# EAGLE design VoltageReferenceProgrammableRevD (EAGLE 6.6.0)
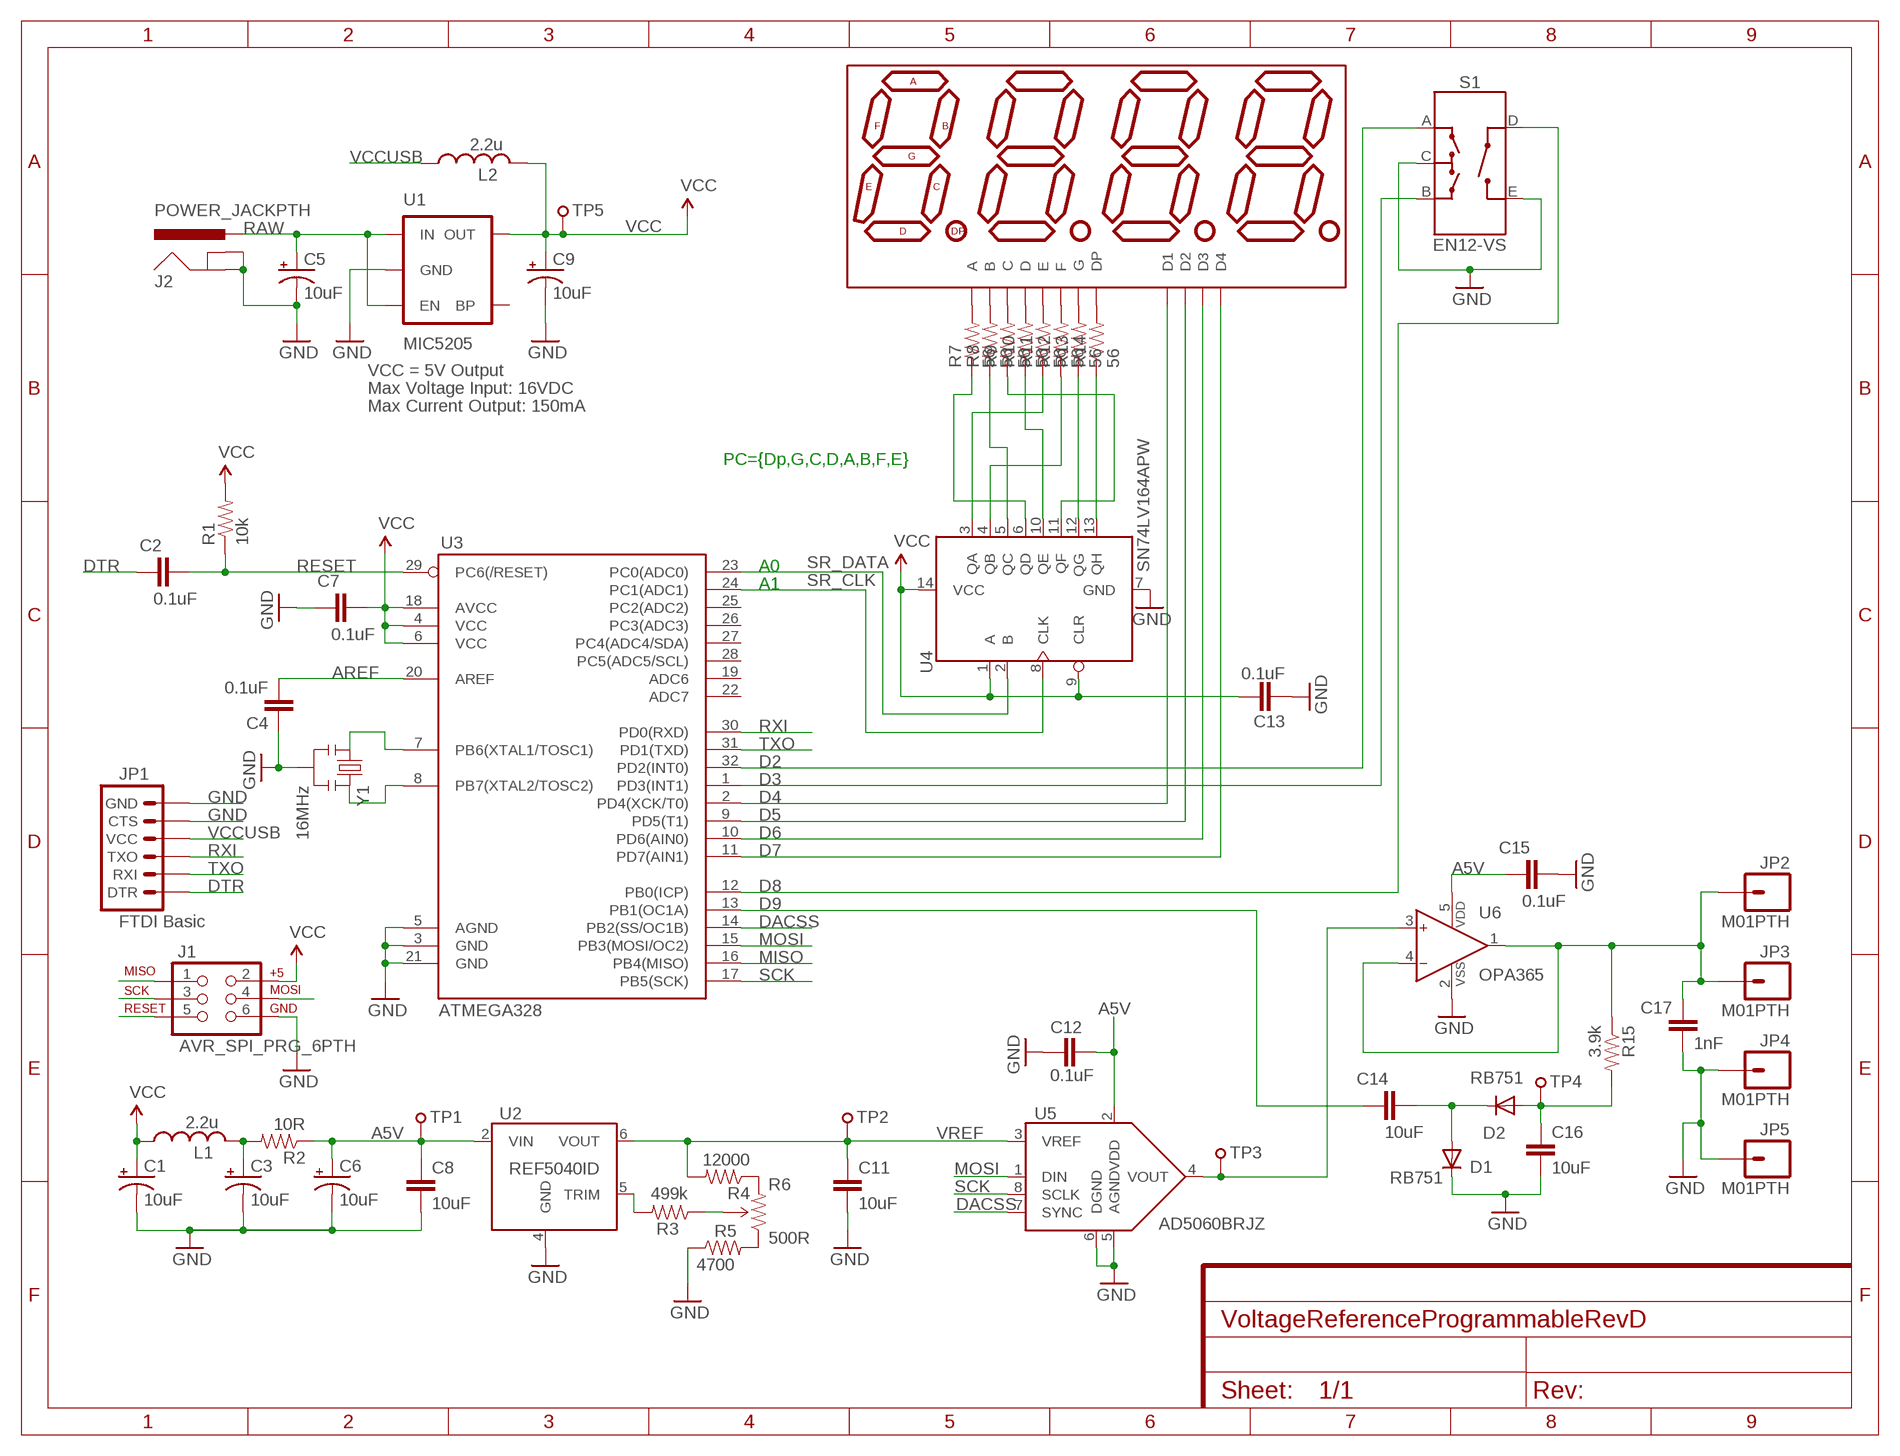
[diagram p0: schematic, sheet 1]

## Parts
C1  10uF  CAP_POL0805  [0805-POL]
C2  0.1uF  CAP0805  [0805]
C3  10uF  CAP_POL0805  [0805-POL]
C4  0.1uF  CAP0805  [0805]
C5  10uF  CAP_POL0805  [0805-POL]
C6  10uF  CAP_POL0805  [0805-POL]
C7  0.1uF  CAP0805  [0805]
C8  10uF  CAP0805  [0805]
C9  10uF  CAP_POL0805  [0805-POL]
C11  10uF  CAP0805  [0805]
C12  0.1uF  CAP0805  [0805]
C13  0.1uF  CAP0805  [0805]
C14  10uF  CAP0805  [0805]
C15  0.1uF  CAP0805  [0805]
C16  10uF  CAP0805  [0805]
C17  1nF  CAP0805  [0805]
D1  RB751  DIODESOD  [SOD-323]
D2  RB751  DIODESOD  [SOD-323]
DISP1  hp  7-SEGMENT-4DIGIT-COUNTER-HP-BUBBLE  [DIL12]
FRAME1  FRAME_LTR_CU_MARK  [FR-LTR-ON-PCB]
J1  AVR_SPI_PRG_6PTH  [2X3]
J2  POWER_JACKPTH  [POWER_JACK_PTH]
JP1  FTDI Basic  ARDUINO_SERIAL_PROGRAMPTH  [1X06]
JP2  M01PTH  [1X01]
JP3  M01PTH  [1X01]
JP4  M01PTH  [1X01]
JP5  M01PTH  [1X01]
L1  2.2u  INDUCTOR  [0805]
L2  2.2u  INDUCTOR  [0805]
R1  10k  RESISTOR0805-RES  [0805]
R2  10R  RESISTOR0805-RES  [0805]
R3  499k  RESISTOR0805-RES  [0805]
R4  12000  RESISTOR0805-RES  [0805]
R5  4700  RESISTOR0805-RES  [0805]
R6  500R  TRIMPOT  [T93YB]
R7  56  RESISTOR0805-RES  [0805]
R8  56  RESISTOR0805-RES  [0805]
R9  56  RESISTOR0805-RES  [0805]
R10  56  RESISTOR0805-RES  [0805]
R11  56  RESISTOR0805-RES  [0805]
R12  56  RESISTOR0805-RES  [0805]
R13  56  RESISTOR0805-RES  [0805]
R14  56  RESISTOR0805-RES  [0805]
R15  3.9k  RESISTOR0805-RES  [0805]
S1  EN12-VS  [ROTARY_ENCODER_SIDE]
TP1  TEST_POINT  [BBD-VIA]
TP2  TEST_POINT  [BBD-VIA]
TP3  TEST_POINT  [BBD-VIA]
TP4  TEST_POINT  [BBD-VIA]
TP5  TEST_POINT  [BBD-VIA]
U1  MIC5205  V_REG_LDOSMD  [SOT23-5]
U2  REF5040ID  [SOIC-8-MINUSPINS]
U3  ATMEGA328  ATMEGA168  [TQFP32-08]
U4  SN74LV164APW  [TSSOP-14(TI)]
U5  AD5060BRJZ  AD5040BRJZ  [SOT-23-8]
U6  OPA365  [SOT-23-5]
Y1  16MHz  RESONATORSMD  [RESONATOR-SMD]

## Nets
A5V: C6.1(+) C8.1 C12.1 C15.1 R2.1 TP1.P$1 U2.2(VIN) U5.2(VDD) U6.5(VDD)
ADCIN: C16.1 D2.2(A) R15.2 TP4.P$1
AREF: C4.2 U3.20(AREF)
D2: S1.A U3.32(PD2(INT0))
D3: S1.B U3.1(PD3(INT1))
D4: DISP1.1(D1) U3.2(PD4(XCK/T0))
D5: DISP1.10(D2) U3.9(PD5(T1))
D6: DISP1.4(D3) U3.10(PD6(AIN0))
D7: DISP1.6(D4) U3.11(PD7(AIN1))
D8: S1.D U3.12(PB0(ICP))
D9: C14.1 U3.13(PB1(OC1A))
DACSS: U3.14(PB2(SS/OC1B)) U5.7(SYNC)
DTR: C2.1 JP1.1(DTR)
GND [vcc]: C1.2(-) C3.2(-) C4.1 C5.2(-) C6.2(-) C7.1 C8.2 C9.2(-) C11.2 C12.2 C13.2 C15.2 C16.2 C17.1 D1.1(C) J1.6 J2.GND J2.GNDBREAK JP1.5(CTS) JP1.6(GND) JP4.1 JP5.1 R5.1 S1.C S1.E U1.2(GND) U2.4(GND) U3.3(GND) U3.5(AGND) U3.21(GND) U4.7(GND) U5.5(AGND) U5.6(DGND) U6.2(VSS) Y1.2
MISO: J1.1 U3.16(PB4(MISO))
MOSI: J1.4 U3.15(PB3(MOSI/OC2)) U5.1(DIN)
N$1: U3.7(PB6(XTAL1/TOSC1)) Y1.1
N$2: U3.8(PB7(XTAL2/TOSC2)) Y1.3
N$3: DISP1.12(A) R7.2
N$4: DISP1.11(B) R8.2
N$5: DISP1.3(C) R9.2
N$6: DISP1.8(D) R10.2
N$7: R14.1 U4.13(QH)
N$8: DISP1.2(E) R11.2
N$9: DISP1.9(F) R12.2
N$10: DISP1.7(G) R13.2
N$11: DISP1.5(DP) R14.2
N$12: TP3.P$1 U5.4(VOUT) U6.3(IN+)
N$13: C17.2 JP2.1 JP3.1 R15.1 U6.1(OUT) U6.4(IN-)
N$14: R3.1 R6.2(WIPER)
N$15: R13.1 U4.12(QG)
N$16: C14.2 D1.2(A) D2.1(C)
N$17: R3.2 U2.5(TRIM)
N$18: R5.2 R6.1(CCW)
N$19: R4.1 R6.3(CW)
N$20: R9.1 U4.11(QF)
N$21: R10.1 U4.10(QE)
N$22: R7.1 U4.6(QD)
N$23: R8.1 U4.5(QC)
N$24: R12.1 U4.4(QB)
N$25: R11.1 U4.3(QA)
N$26: C3.1(+) L1.2 R2.2
RAW [vcc]: C5.1(+) J2.PWR U1.1(IN) U1.3(EN)
RESET: C2.2 J1.5 R1.1 U3.29(PC6(/RESET))
RXI: JP1.3(TXO) U3.30(PD0(RXD))
SCK: J1.3 U3.17(PB5(SCK)) U5.8(SCLK)
SR_CLK: U3.24(PC1(ADC1)) U4.8(CLK)
SR_DATA: U3.23(PC0(ADC0)) U4.2(B)
TXO: JP1.2(RXI) U3.31(PD1(TXD))
VCC: C1.1(+) C7.2 C9.1(+) C13.1 J1.2 L1.1 L2.2 R1.2 TP5.P$1 U1.5(OUT) U3.4(VCC) U3.6(VCC) U3.18(AVCC) U4.1(A) U4.9(CLR) U4.14(VCC)
VCCUSB: JP1.4(VCC) L2.1
VREF: C11.1 R4.2 TP2.P$1 U2.6(VOUT) U5.3(VREF)
Unconnected: U1.4(BP) U3.19(ADC6) U3.22(ADC7) U3.25(PC2(ADC2)) U3.26(PC3(ADC3)) U3.27(PC4(ADC4/SDA)) U3.28(PC5(ADC5/SCL))

## Notes on the sheet
- VCC = 5V Output
- Max Voltage Input: 16VDC
- Max Current Output: 150mA
- PC={Dp,G,C,D,A,B,F,E}
- A0
- A1

## Library data of the parts
C1 C3 C5 C6 C9 = ChipsParts:CAP_POL
C2 C4 C7 C8 C11-C17 = SparkFun-Capacitors:CAP: Capacitor Standard 0603 ceramic capacitor, and 0.1" leaded capacitor.
D1 D2 = SparkFun-DiscreteSemi:DIODE: Diode These are standard reverse protection diodes and small signal diodes. SMA package can handle up to about 1A. SOD-323 can handle about 200mA. What the SOD-323 package when ordering, there are some mfgs out there that are 5-pin packages.
DISP1 = SparkFun-Displays:7-SEGMENT-4DIGIT-COUNTER
FRAME1 = NewFrame:FRAME_LTR_CU_MARK: This frame is sized for an 8.5x11" page with a 0.25" margin. It also places a name, datecode and revision mark in the bottom copper layer of the PCB.; CNAME: C.Schnarel; CREVISION: ProgVRef Rev-D; DATECODE: 24AUG2014; DESIGNER: C.Schnarel
J1 = SparkFun-Connectors:AVR_SPI_PRG_6: AVR ISP 6 Pin This is the reduced ISP connector for AVR programming. Common on Arduino. This footprint will take up less PCB space and can be used with a 10-pin to 6-pin adapter such as SKU: BOB-08508 **Special note about "TEST_POINT" package. The stop mask is on the top side, so if you want your programming test points to be on the bottom of your board, make sure to place this package on the bottom side of the board. This also ensure that the orientation to program from the bottom side will be correct.
J2 = SparkFun-Connectors:POWER_JACK: Power Jack This is the standard 5.5mm barrel jack for power. The PTH is the most common, proven, reliable, footprint. The Slot footprint only works if the mill layer is transmitted to the PCB fab house so be warned. Spark Fun Electronics SKU : PRT-00119 SMT: CONN-08106 Mating wall wart : TOL-00298 (and others)
JP1 = SparkFun:ARDUINO_SERIAL_PROGRAM
JP2-JP5 = SparkFun-Connectors:M01: Header 1 Standard 1-pin 0.1" header. Use with straight break away headers (SKU : PRT-00116), right angle break away headers (PRT-00553), swiss pins (PRT-00743), machine pins (PRT-00117), and female headers (PRT-00115).
L1 L2 = ChipsParts:INDUCTOR: Inductor, SMT chip, 0805 pkg
R1-R5 R7-R15 = SparkFun-Resistors:RESISTOR: Resistor Basic schematic elements and footprints for 0603, 1206, and PTH resistors.
R6 = ChipsParts:TRIMPOT: Various small potentiometers for "set-and-forget" applications
S1 = ChipsParts:EN12-VS: Rotary Encoder w push switch, quadrature, 12 pulse/rev. BI Technologies. Digi-key#987-1198-ND
TP1-TP5 = ChipsParts:TEST_POINT: Test Point
U1 = SparkFun:V_REG_LDO: Voltage Regulator LDO Standard 150mA LDO voltage regulator in SOT-23 layout. Micrel part MIC5205. BP (by-pass) pin is used to lower output noise with 470pF cap.
U2 = ChipsParts:REF5040
U3 = SparkFun:ATMEGA168
U4 = ChipsParts:SN74LV164A: 8-BIT SERIAL-IN PARALLEL-OUT SHIFT REGISTER with clear
U5 = ChipsParts:AD5040
U6 = ChipsParts:OPA365: OpAmp, 50MHz, R-to-R, single-supply, CMOS, TI, Digi-Key#296-20645-1-ND
Y1 = SparkFun-FreqCtrl:RESONATOR: Resonator Small SMD resonator. This is the itty bitty 10/20MHz resonators with built in caps. CSTCE10M0G55 and CSTCE20M0V53. Footprint has been reviewed closely but hasn't been tested yet.

## Net classes
1 vcc: width 0.254 mm

## Board
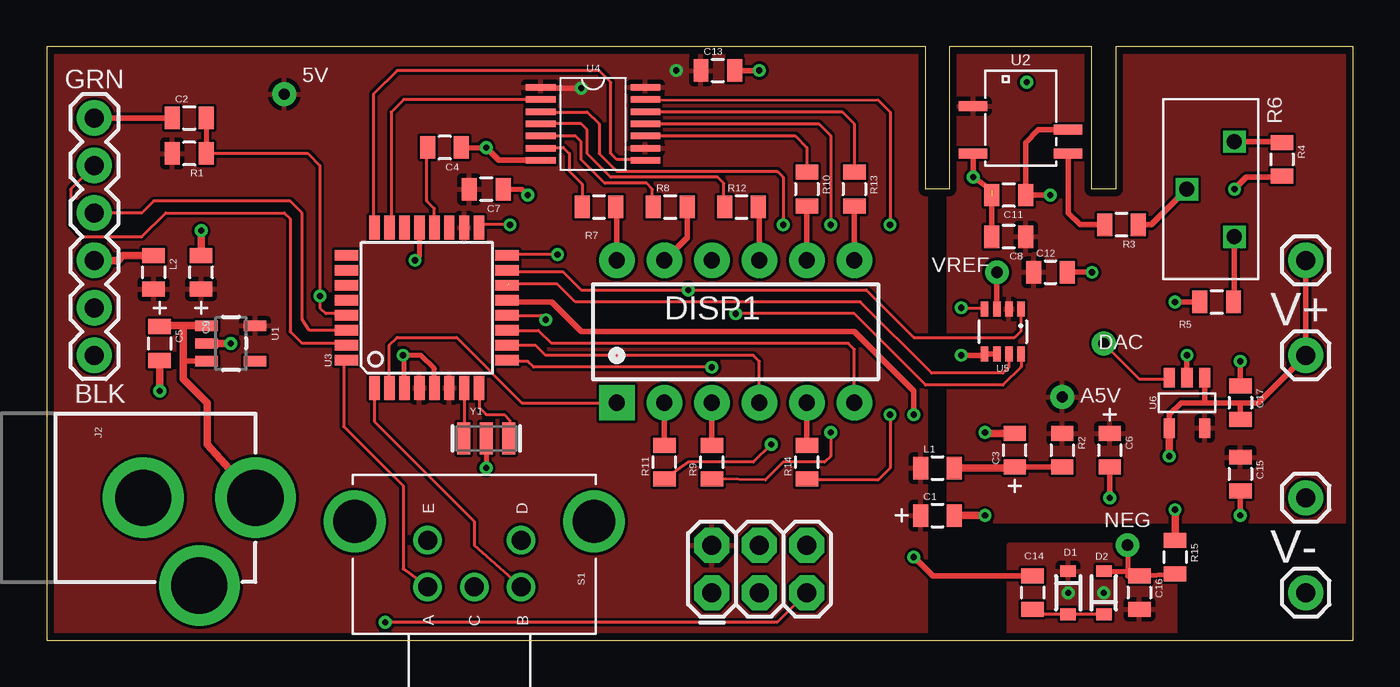
[diagram p1: board, top side]
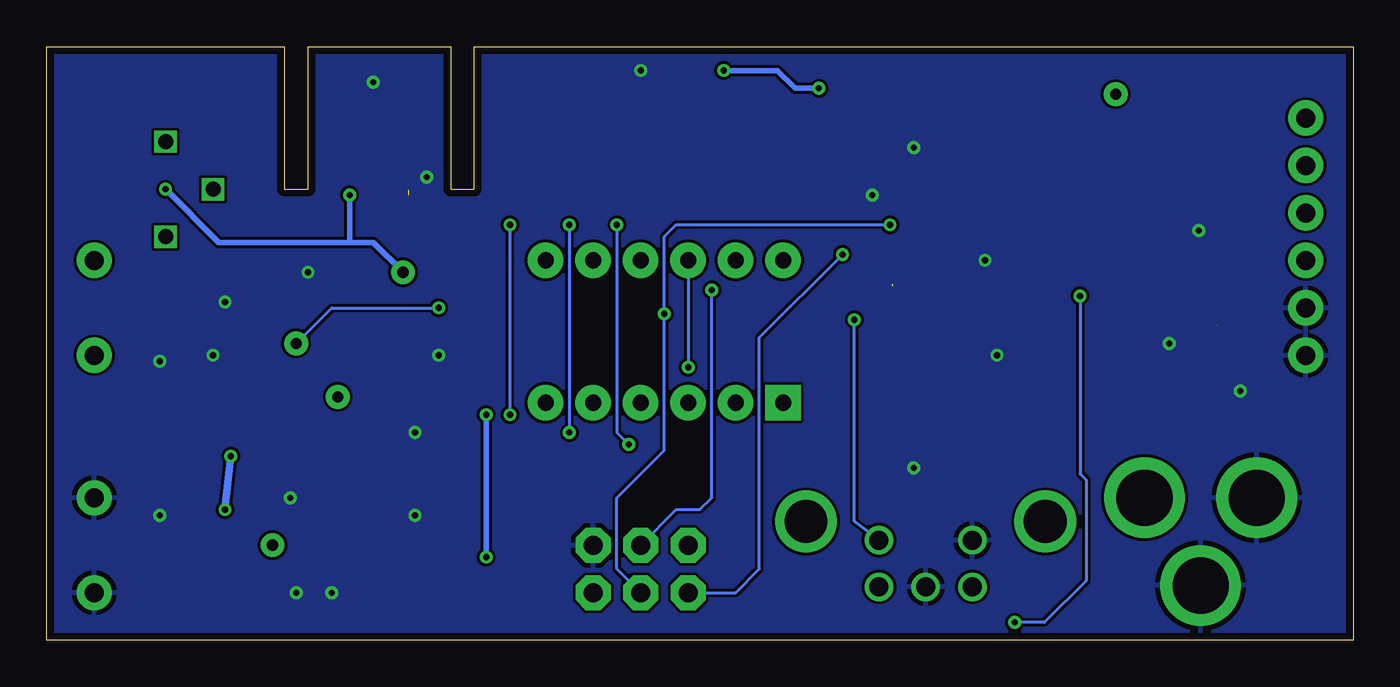
[diagram p2: board, bottom side, seen from below]

Size 69.85 x 31.75 mm. Coordinates in mm from the lower left corner, seen from the top.
Outline: 0,0 69.85,0 69.85,31.75 57.15,31.75 57.15,24.13 55.88,24.13 55.88,31.75 48.26,31.75 48.26,24.13 46.99,24.13 46.99,31.75 0,31.75 0,0
Copper layers (1*16): Top 0.0356mm / dielectric 1.5011mm / Bottom 0.0356mm
Design rules "LaenPCBOrder": minimum track width 6mil, minimum drill 13mil, track to track 6mil, track to pad 6mil, pad to pad 6mil, via to via 6mil, smd to smd 6mil, copper to edge 15mil, drill to drill 6mil, minimum pad ring 7mil, minimum via ring 7mil, stop-mask expansion 4mil, vias tented up to drill 0mil, thermal gap 10mil

### Footprints (pad centres in the part's own frame; a part is rotated, then mirrored left to right if it is on the bottom)
0805-POL = smd 0.8 x 1.2: 1 -0.9,0; 2 0.9,0
0805 = smd 0.8 x 1.2: 1 -0.9,0; 2 0.9,0
SOD-323 = smd 0.63 x 0.83: 1 -1.15,0; 2 1.15,0
DIL12 = drill 0.864 pad 1.905 square: 1 -6.35,-3.81 | drill 0.864 pad 1.905: 2 -3.81,-3.81; 3 -1.27,-3.81; 4 1.27,-3.81; 5 3.81,-3.81; 6 6.35,-3.81; 7 6.35,3.81; 8 3.81,3.81; 9 1.27,3.81; 10 -1.27,3.81; 11 -3.81,3.81; 12 -6.35,3.81
2X3 = drill 1.016 pad 1.88 octagon: 1 0,0; 2 0,2.54; 3 2.54,0; 4 2.54,2.54; 5 5.08,0; 6 5.08,2.54
POWER_JACK_PTH = drill 2.997 pad 4.318: GND 0,7.7; GNDBREAK 4.7,10.7; PWR 0,13.7
1X06 = drill 1.016 pad 1.88: 1 0,0; 2 2.54,0; 3 5.08,0; 4 7.62,0; 5 10.16,0; 6 12.7,0
1X01 = drill 1.016 pad 1.88: 1 0,0
T93YB = drill 0.8 square: 1 -1.27,2.54; 2 1.27,0; 3 -1.27,-2.54
ROTARY_ENCODER_SIDE = drill 1.016: A 3.5,-2.5; B 3.5,2.5; C 3.5,0; D 1,2.5; E 1,-2.5 | drill 2.286: P$3 0,6.4; P$4 0,-6.4
BBD-VIA = drill 0.6 pad 1.27: P$1 0,0
SOT23-5 = smd 0.55 x 1.2: 1 -0.95,-1.3; 2 0,-1.3; 3 0.95,-1.3; 4 0.95,1.3; 5 -0.95,1.3
SOIC-8-MINUSPINS = smd 1.524 x 0.53: 2 -2.54,0.635; 4 -2.54,-1.905; 5 2.54,-1.905; 6 2.54,-0.635
TQFP32-08 = smd 1.27 x 0.559: 1 -4.293,2.8; 2 -4.293,2; 3 -4.293,1.2; 4 -4.293,0.4; 5 -4.293,-0.4; 6 -4.293,-1.2; 7 -4.293,-2; 8 -4.293,-2.8; 17 4.293,-2.8; 18 4.293,-2; 19 4.293,-1.2; 20 4.293,-0.4; 21 4.293,0.4; 22 4.293,1.2; 23 4.293,2; 24 4.293,2.8 | smd 0.559 x 1.27: 9 -2.8,-4.293; 10 -2,-4.293; 11 -1.2,-4.293; 12 -0.4,-4.293; 13 0.4,-4.293; 14 1.2,-4.293; 15 2,-4.293; 16 2.8,-4.293; 25 2.8,4.293; 26 2,4.293; 27 1.2,4.293; 28 0.4,4.293; 29 -0.4,4.293; 30 -1.2,4.293; 31 -2,4.293; 32 -2.8,4.293
TSSOP-14(TI) = smd 1.6 x 0.35: 1 -2.8,1.95; 2 -2.8,1.3; 3 -2.8,0.65; 4 -2.8,0; 5 -2.8,-0.65; 6 -2.8,-1.3; 7 -2.8,-1.95; 8 2.8,-1.95; 9 2.8,-1.3; 10 2.8,-0.65; 11 2.8,0; 12 2.8,0.65; 13 2.8,1.3; 14 2.8,1.95
SOT-23-8 = smd 0.4 x 0.8: 1 -0.975,-1.2; 2 -0.325,-1.2; 3 0.325,-1.2; 4 0.975,-1.2; 5 0.975,1.2; 6 0.325,1.2; 7 -0.325,1.2; 8 -0.975,1.2
SOT-23-5 = smd 0.6 x 1.05: 1 -0.95,-1.35; 2 0,-1.35; 3 0.95,-1.35; 4 0.95,1.35; 5 -0.95,1.35
RESONATOR-SMD = smd 0.7 x 1.7: 1 -1.2,0; 2 0,0; 3 1.2,0

### Placement (x,y rotation side)
C1  47.62,6.67 0 top
C2  7.62,27.94 0 top
C3  51.75,10.16 90 top
C4  21.27,26.35 180 top
C5  6.03,15.88 270 top
C6  56.83,10.16 270 top
C7  23.5,24.13 180 top
C8  51.44,21.59 180 top
C9  8.26,19.68 90 top
C11  51.44,23.81 180 top
C12  53.66,19.68 0 top
C13  35.88,30.48 0 top
C14  52.7,2.54 270 top
C15  63.82,8.89 270 top
C16  58.42,2.54 270 top
C17  63.82,12.7 270 top
D1  54.61,2.54 270 top
D2  56.52,2.54 90 top
DISP1  36.83,16.51 0 top
FRAME1  45.72,27.62 0 top
J1  35.56,2.54 0 top
J2  -2.54,7.62 270 top
JP1  2.54,27.94 270 top
JP2  67.31,15.24 0 top
JP3  67.31,20.32 0 top
JP4  67.31,2.54 0 top
JP5  67.31,7.62 0 top
L1  47.62,9.21 0 top
L2  5.71,19.68 270 top
R1  7.62,26.04 180 top
R2  54.29,10.16 270 top
R3  57.47,22.23 180 top
R4  66.04,25.72 270 top
R5  62.55,18.1 0 top
R6  62.23,24.13 180 top
R7  29.53,23.18 0 top
R8  33.34,23.18 0 top
R9  35.56,9.53 90 top
R10  40.64,24.13 270 top
R11  33.02,9.53 90 top
R12  37.15,23.18 0 top
R13  43.18,24.13 270 top
R14  40.64,9.53 90 top
R15  60.33,4.45 270 top
S1  22.86,6.35 270 top
TP1  54.29,13.02 0 top
TP2  50.8,19.68 0 top
TP3  56.52,15.88 0 top
TP4  57.78,5.08 0 top
TP5  12.7,29.21 0 top
U1  9.84,15.88 270 top
U2  52.07,27.94 0 top
U3  20.32,17.78 90 top
U4  29.21,27.62 0 top
U5  51.12,16.51 180 top
U6  60.96,12.7 180 top
Y1  23.5,10.79 0 top

### Tracks (layer width: path | path; a pad name or v marks a point on that pad's centre or on a via)
A5V
  pour Top: 48.26,31.75 55.88,31.75 55.88,24.13 57.15,24.13 57.15,31.75 69.85,31.75 69.85,6.35 48.26,6.35
ADCIN
  Top 0.152: 58.17,3.69 C16.1
  Top 0.254: D2.2 58.17,3.69 | R15.2 C16.1 57.78,3.44 TP4.P$1
AREF
  Top 0.152: U3.20 20.72,23.09 20.32,23.5 20.32,26.3 C4.2
D2
  Top 0.152: S1.A 19.05,3.81 19.05,8.26 15.88,11.43 15.88,14.83 U3.32
D3
  Top 0.152: U3.1 17.52,11.69 22.86,6.35 22.86,5.08 S1.B
D4
  Top 0.152: U3.2 18.32,15.78 18.73,16.19 21.91,16.19 25.4,12.7 DISP1.1
D5  (via drill 0.33)
  Top 0.152: v35.56,14.61 26.04,14.61 25.72,14.92 24.67,14.92 U3.9
  Bottom 0.152: DISP1.10 v35.56,14.61
D6
  Top 0.152: DISP1.4 38.1,14.92 37.78,15.24 26.67,15.24 26.13,15.78 U3.10
D7
  Top 0.152: DISP1.6 43.18,15.56 42.86,15.88 26.99,15.88 26.28,16.58 U3.11
D8  (via drill 0.33)
  Top 0.152: U3.12 26.43,17.38 v26.67,17.14
  Bottom 0.152: S1.D 25.4,5.39 26.67,6.35 v26.67,17.14
D9  (via drill 0.33 pad 0.69)
  Top 0.305: U3.13 24.7,18.1 26.99,18.1 28.57,16.51 43.18,16.51 46.35,13.34 v46.35,12.06 | v46.35,4.45 47.36,3.44 C14.1
  Bottom 0.305: v46.35,12.06 v46.35,4.45
DACSS  (1 unrouted)
  Top 0.152: U5.7 51.44,14.61 51.12,14.29 47.31,14.29 43.5,18.1 28.26,18.1 27.3,19.05 24.68,19.05
DTR
  Top 0.305: C2.1 JP1.1
GND  (via drill 0.33, 0.33 pad 0.69)  (1 unrouted)
  Top 0.254: C4.1 v23.5,26.35 | C7.1 25.4,24.13 v25.72,23.81 | U3.21 19.92,20.55 v19.68,20.32 | U3.3 19.12,15.17 v19.05,15.24 20,15.24 20.72,14.52 U3.5 | Y1.2 v23.5,9.21
  Top 0.305: U2.4 v49.53,24.77 50.53,24.08 C8.2 | C12.2 v55.88,19.68 | U5.6 U5.5 | 50.07,15.24 v48.9,15.24 | R5.1 v60.33,18.1 | C15.2 v63.82,6.67 | C6.2 v56.83,7.62 | U6.2 v60.96,15.24 | U4.7 24.18,25.67 v23.5,26.35 | C13.2 v38.1,30.48 | C17.1 v63.82,14.92
  Top 0.406: U5.5 50.07,15.24 | C5.2 v6.03,13.34 | U1.2 v9.84,15.88 | C9.2 v8.26,21.91 | C3.2 50.22,11.06 v50.16,11.11 | C1.2 v50.16,6.67
  other vias: 52.39,29.84 54.61,2.54 56.52,2.54
  pour Top: 51.44,0 60.33,0 60.33,5.08 51.44,5.08
  pour Bottom: 0,0 69.85,0 69.85,31.75 57.15,31.75 57.15,24.13 55.88,24.13 55.88,31.75 48.26,31.75 48.26,24.13 46.99,24.13 46.99,31.75 0,31.75
MISO  (via drill 0.33 pad 0.69)
  Top 0.152: v27.3,20.64 24.67,20.64 U3.16
  Bottom 0.152: J1.1 33.02,2.54 31.75,3.81 31.75,16.19 v27.3,20.64
MOSI  (via drill 0.33 pad 0.69)
  Top 0.152: U5.1 52.07,17.69 52.07,16.51 51.75,16.19 46.35,16.19 43.81,18.73 v34.29,18.73 28.57,18.73 27.62,19.68 24.71,19.68 U3.15
  Bottom 0.152: J1.4 36.2,6.99 34.92,6.99 34.29,7.62 v34.29,18.73
N$1
  Top 0.152: U3.7 22.32,10.82 Y1.1
N$2
  Top 0.152: U3.8 23.12,12.44 23.5,12.06 24.45,12.06 24.77,11.75 24.77,10.87 Y1.3
N$3
  Top 0.152: R7.2 30.48,23.12
  Top 0.305: 30.48,23.12 DISP1.12
N$4
  Top 0.305: DISP1.11 34.24,21.54 R8.2
N$5
  Top 0.305: R9.2 DISP1.3
N$6
  Top 0.305: R10.2 DISP1.8
N$7  (via drill 0.33)
  Top 0.152: U4.13 44.45,28.89 45.09,28.26 v45.09,22.23 | v45.09,12.06 45.09,9.21 44.45,8.57 40.69,8.57 R14.1
  Bottom 0.152: v45.09,22.23 v45.09,12.06
N$8
  Top 0.305: R11.2 DISP1.2
N$9
  Top 0.152: 38.1,23.12 R12.2
  Top 0.305: DISP1.9 38.1,23.12
N$10
  Top 0.305: R13.2 DISP1.7
N$11
  Top 0.305: R14.2 DISP1.5
N$12  (via drill 0.33)
  Top 0.152: TP3.P$1 58.42,13.97 59.93,13.97 U6.3 | v48.9,17.78 50.07,17.78 U5.4
  Bottom 0.152: TP3.P$1 54.61,17.78 v48.9,17.78
N$13  (via drill 0.33)
  Top 0.152: U6.4 | U6.1
  Top 0.305: U6.4 60.01,12.06 60.64,12.7 61.91,12.7 | U6.1 61.91,12.7 | 61.91,12.7 63.82,12.7 | 63.82,12.7 64.77,12.7 JP2.1 JP3.1 | C17.2 63.82,12.7
  Top 0.406: R15.1 v60.33,6.99 | v60.01,9.84 U6.4
  Bottom 0.406: v60.33,6.99 v60.01,9.84
N$14
  Top 0.305: R3.1 59.05,22.23 R6.2
N$15
  Top 0.152: U4.12 42.53,28.27 43.18,27.62 R13.1
N$16
  Top 0.152: D2.1 D1.2 52.95,1.39 C14.2
N$17
  Top 0.305: U2.5 54.61,22.86 55.24,22.23 R3.2
N$18
  Top 0.152: R5.2 63.5,18.15
  Top 0.305: 63.5,18.15 R6.1
N$19
  Top 0.305: R4.1 65.99,26.67 R6.3
N$20  (via drill 0.33)
  Top 0.152: U4.11 41.27,27.62 41.91,26.99 v41.91,22.23 | v41.91,11.11 41.91,9.84 41.59,9.53 39.37,9.53 38.42,8.57 R9.1
  Bottom 0.152: v41.91,22.23 v41.91,11.11
N$21
  Top 0.152: U4.10 32.02,26.99 40.01,26.99 40.64,26.35 R10.1
N$22
  Top 0.152: U4.6 26.44,26.35 27.62,26.35 27.94,26.04 27.94,25.08 28.63,24.39 R7.1
N$23
  Top 0.152: R8.1 32.38,23.23 32.38,24.13 32.07,24.45 29.84,24.45 28.57,25.72 28.57,26.67 28.26,26.99 28.24,26.97 U4.5
N$24
  Top 0.152: U4.4 28.57,27.62 28.89,27.3 28.89,26.04 30.16,24.77 35.88,24.77 36.2,24.45 36.2,23.23 R12.1
N$25  (via drill 0.33)
  Top 0.152: U4.3 26.43,28.26 28.89,28.26 29.53,27.62 29.53,26.04 30.48,25.08 39.05,25.08 39.37,24.77 v39.37,22.23 | v38.73,10.48 37.78,9.53 34.29,9.53 R11.1
  Bottom 0.152: v39.37,22.23 39.37,11.11 v38.73,10.48
N$26
  Top 0.305: R2.2 C3.1
  Top 0.406: C3.1 51.7,9.21 L1.2
RAW  (1 unrouted)
  Top 0.305: 7.3,16.82 7.3,15.24 7.3,14.93 U1.3
  Top 0.406: U1.1 7.3,16.82 6.4,16.82 C5.1 | J2.PWR 8.57,10.48 8.57,12.7 7.3,13.97 7.3,16.83
RESET  (via drill 0.33)
  Top 0.152: U3.29 15.95,17.46 14.92,17.46 14.61,17.78 v14.61,18.41 14.61,25.4 13.97,26.04 R1.1 | J1.5 39.05,0.95 v18.1,0.95
  Top 0.254: C2.2 R1.1
  Bottom 0.152: v14.61,18.41 14.61,8.89 14.29,8.57 14.29,3.17 16.51,0.95 v18.1,0.95
RXI
  Top 0.152: U3.30 14.04,16.58 13.65,17.14 13.65,22.86 13.02,23.5 5.71,23.5 5.08,22.86 JP1.3
SCK  (via drill 0.33, 0.33 pad 0.69)
  Top 0.152: U5.8 52.09,14.63 51.12,13.65 46.99,13.65 43.18,17.46 v36.83,17.46 | v24.77,22.23 23.27,22.23 U3.17
  Bottom 0.152: J1.3 39.37,3.81 39.37,7.62 36.83,10.16 v36.83,17.46 36.83,21.59 36.2,22.23 v24.77,22.23
SR_CLK
  Top 0.152: U3.24 17.46,22.13 17.46,29.21 18.73,30.48 29.53,30.48 30.16,29.84 30.16,26.04 30.48,25.72 31.96,25.72 U4.8
SR_DATA
  Top 0.152: U4.2 19.08,28.92 18.41,28.26 18.41,22.17 U3.23
TXO
  Top 0.152: JP1.2 1.27,24.13 1.27,22.23 1.91,21.59 5.08,21.59 6.35,22.86 12.7,22.86 13.02,22.54 13.02,16.51 13.65,15.88 15.93,15.88 U3.31
VCC  (via drill 0.33)
  Top 0.305: U4.1 26.45,29.53 v28.57,29.53
  Bottom 0.305: v28.57,29.53 29.84,29.53 30.8,30.48 v33.66,30.48
  pour Top: 0,0 46.99,0 46.99,31.75 0,31.75
VCCUSB
  Top 0.406: L2.1 4.08,20.59 3.81,20.32 JP1.4
VREF  (via drill 0.33)
  Top 0.152: U5.3
  Top 0.305: U5.3 TP2.P$1 | U2.6 53.02,27.3 52.34,26.62 C11.1 v53.66,23.81 | v63.5,24.13 64.14,24.77 65.99,24.77 R4.2
  Bottom 0.305: TP2.P$1 52.39,21.27 53.66,21.27 | 53.66,21.27 60.64,21.27 v63.5,24.13 | v53.66,23.81 53.66,21.27

### Text on the board
tPlace: GRN | 5V | VREF | V+ | DAC | BLK | A5V | NEG | V-